# EasyEDA schematic FAN_Dimmer_RE.json
TITLE: Sheet_1; REV: 1.0; Date: 2024-11-26; Sheet: 1/1; Drawn By: AmirB; Company: Your Company
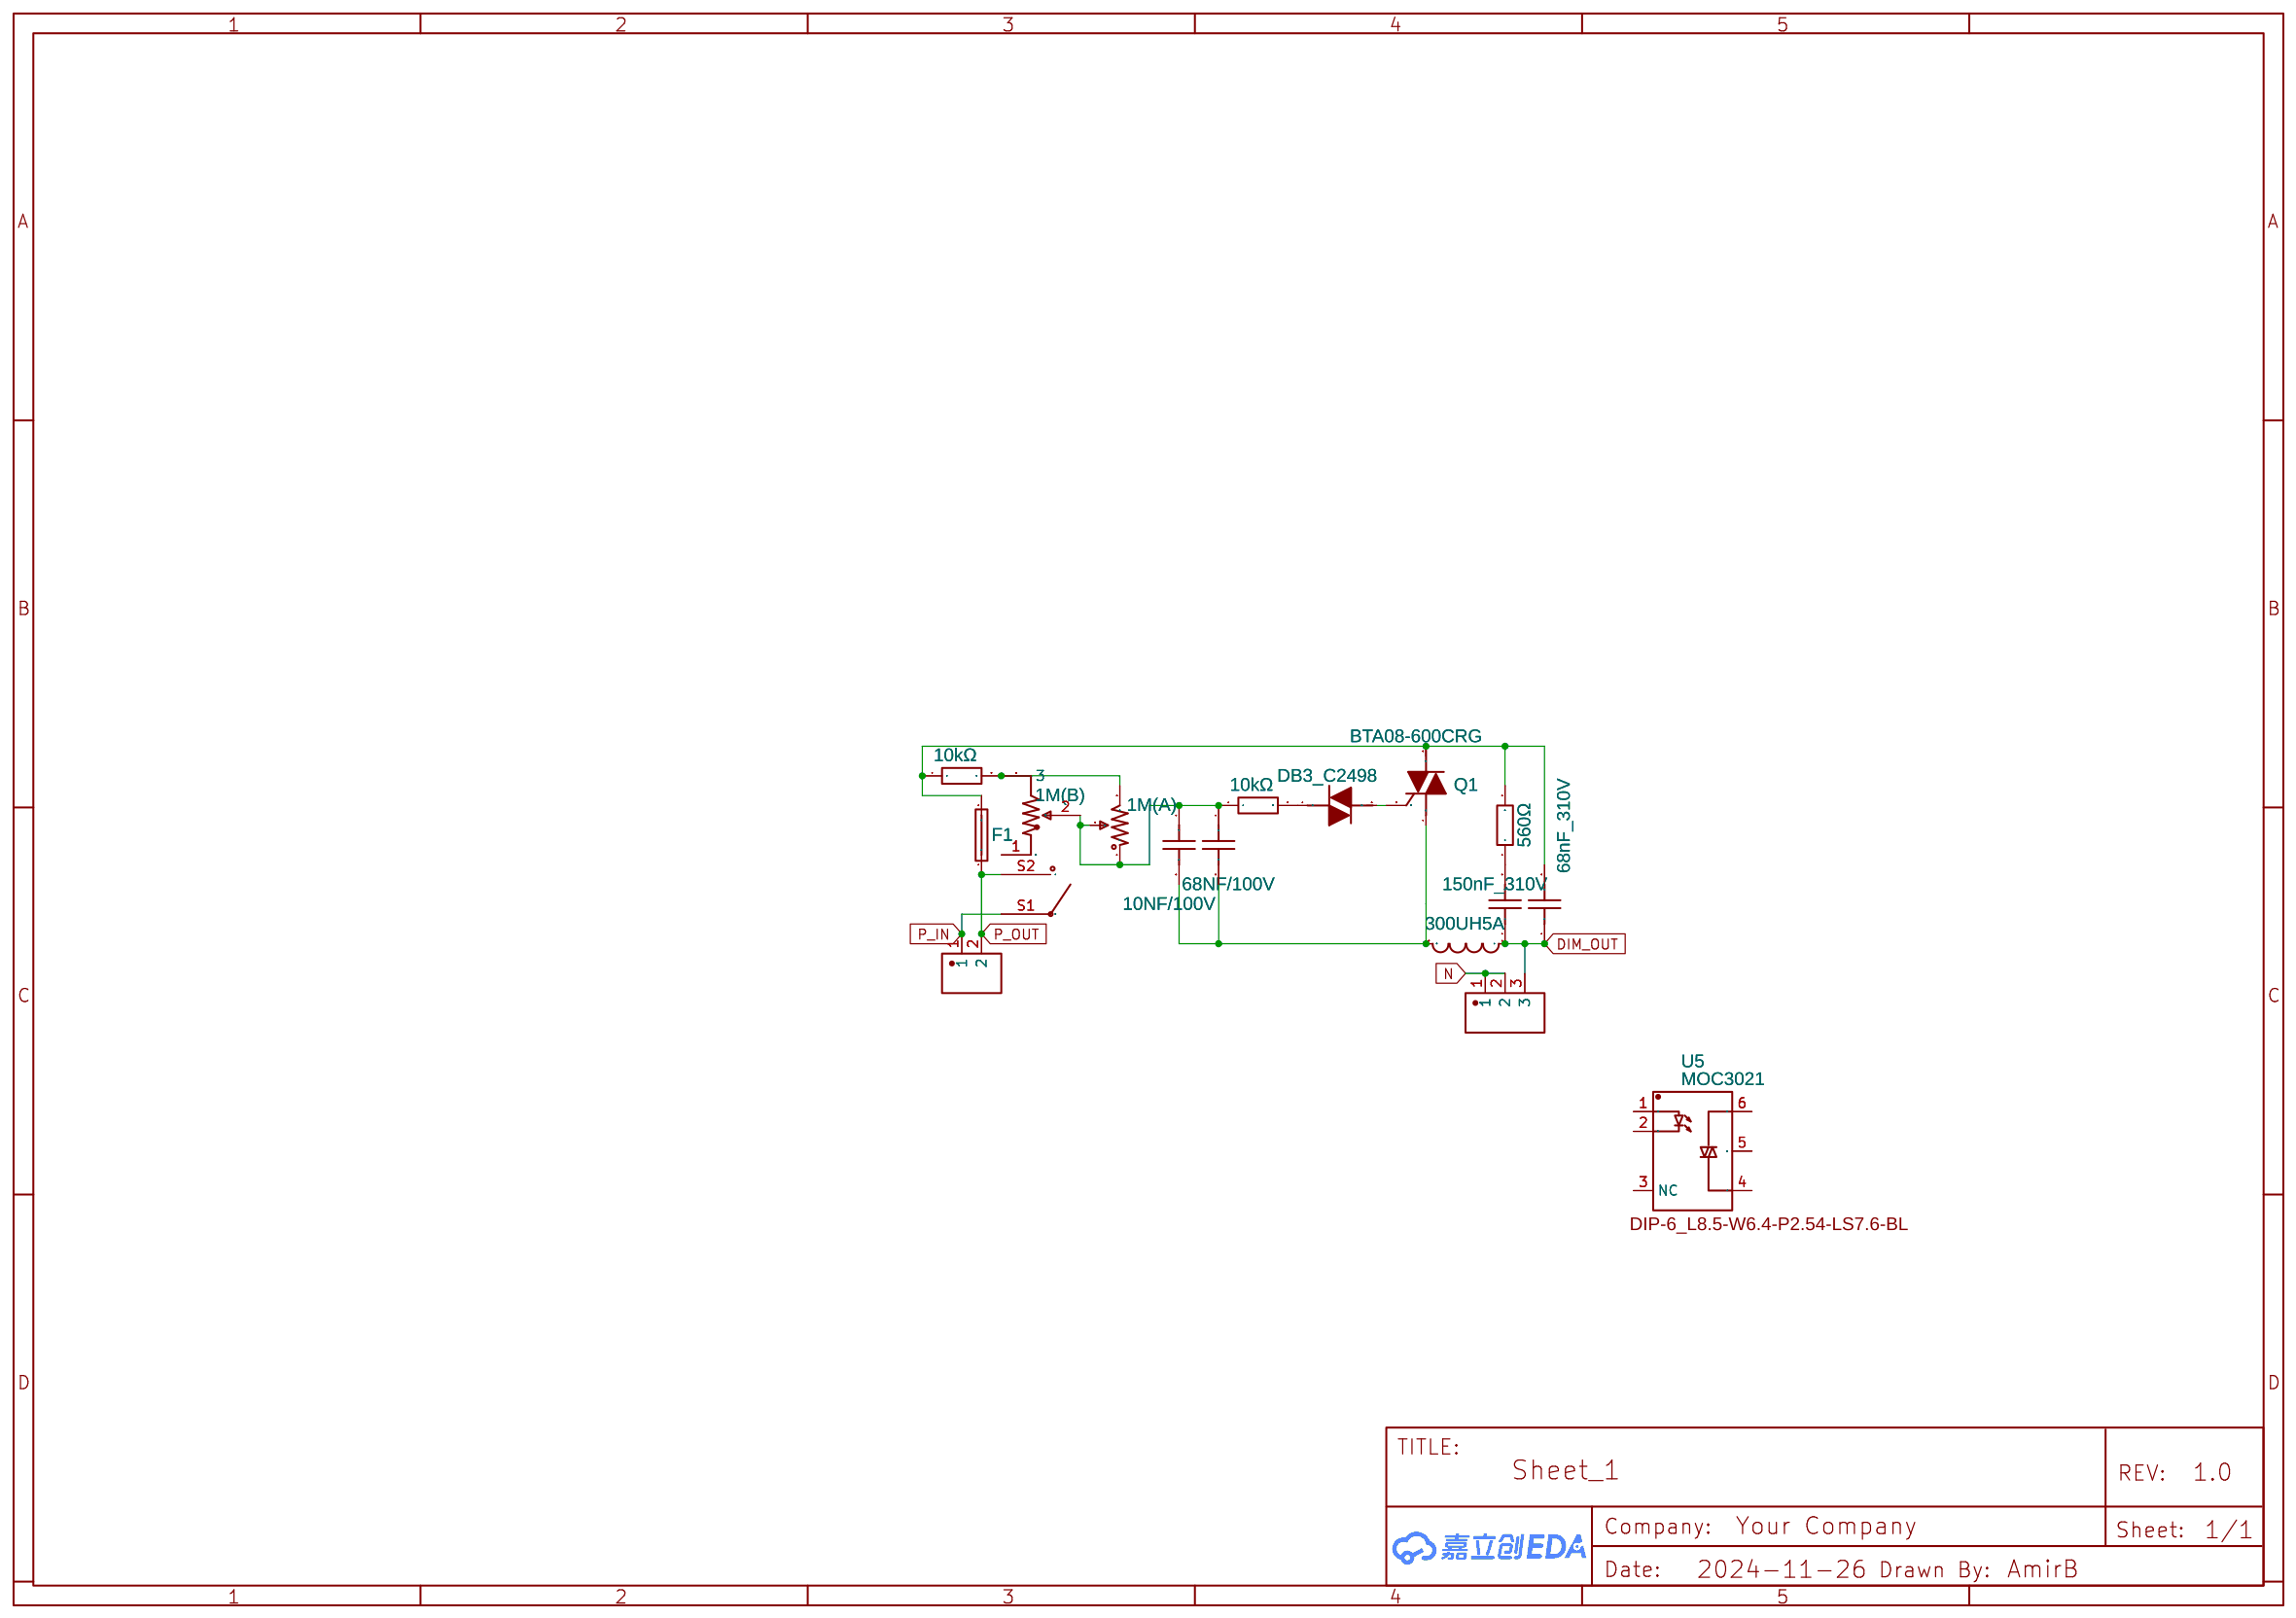
[diagram p0: schematic sheet]

## Parts
C1  68NF/100V  [CAP-TH_L26.4-W7.0-P22.50-D0.7]
C2  10NF/100V  [CAP-TH_L26.4-W7.0-P22.50-D0.7]
C3  68nF_310V  [CAP-TH_L18.0-W6.0-P15.00-D0.6]
C4  150nF_310V  [CAP-TH_L18.0-W6.0-P15.00-D0.6]
F1  0215002.MXEP  [FUSE-TH_BD5.5-L21.5-P25.50-D0.7]
P7  1M(A)  [RES-ADJ-TH_3P-L10.0-W10.0-P2.50-L]
Q1  BTA08-600CRG  [TO-220-3_L10.0-W4.5-P2.54-L]
Q3  DB3_C2498  [DO-35_BD2.0-L4.0-P8.00-D0.5-FD]
R2  1M(B)  [5PIN RV097NS WITH A SWITCH]
RL1V  10kΩ  [R0603]
RL12V  10kΩ  [R0603]
U1  KF301R-5.0-3P  [CONN-TH_3P-P5.00_KF301R-5.0-3P]
U2  KF301-5.0-2P  [CONN-TH_P5.00_KF301-5.0-2P]
U3  300UH5A  [IND-TH_BD26.0-P10.80_300UH5A]
U4  560Ω  [RES-TH_BD4.5-L11.5-P15.50-D0.8]
U5  MOC3021  [DIP-6_L8.5-W6.4-P2.54-LS7.6-BL]

## Library data of the parts
C1 C2 = 68NF/1000V: Contributor: lcsc; Supplier: LCSC; Supplier Part: C9900021245; Manufacturer: null; JLCPCB Part Class: Extended Part; Package Display: No
C3 C4 = K155K310VD7L15: Contributor: lcsc; Supplier: LCSC; Supplier Part: C2686078; Manufacturer: JIERONG(捷容); JLCPCB Part Class: Extended Part; Package Display: No
F1 = 0215002.MXEP: Contributor: LCSC; Supplier: LCSC; Supplier Part: C142787; Manufacturer: Littelfuse(美国力特); JLCPCB Part Class: Extended Part; Package Display: No
P7 = 3296W-1-103: Resistance(Ohms): 10K; Contributor: LCSC; JLCPCB Part Class: Extended Part; Package Display: No
Q1 = BTA08-600CRG: Supplier: LCSC; Manufacturer: ST(意法半导体); Supplier Part: C9102; JLCPCB Part Class: Extended Part; Package Display: No
Q3 = DB3_C2498: Supplier: LCSC; Manufacturer: ST(先科); Supplier Part: C2498; JLCPCB Part Class: Extended Part; Package Display: No
R2 = 5Pin RV097NS with a Switch: Manufacturer Part: RV097NS; Supplier Part: undefined; Contributor: Home Made Channel; Package Display: No
RL1V RL12V = 0603WAF1002T5E: Supplier: LCSC; Manufacturer: UNI-ROYAL(厚声); Supplier Part: C25804; Resistance (Ohms): 10K; JLCPCB Part Class: Basic Part; Package Display: No
U1 = KF301R-5.0-3P: Contributor: LCSC; Supplier: LCSC; Supplier Part: C474884; Manufacturer: KEFA(科发); JLCPCB Part Class: Extended Part; Package Display: No
U2 = KF301-5.0-2P: Contributor: LCSC; Supplier: LCSC; Supplier Part: C474881; Manufacturer: KEFA(科发); JLCPCB Part Class: Extended Part; Package Display: No
U3 = 300UH5A: Contributor: LCSC; Supplier: LCSC; Supplier Part: C9900011335; Manufacturer: null; JLCPCB Part Class: Extended Part; Package Display: No
U4 = CFR2WSJR-73-560R: Contributor: lcsc; Supplier: LCSC; Supplier Part: C1757877; Manufacturer: YAGEO(国巨); JLCPCB Part Class: Extended Part; Package Display: No
U5 = MOC3021: Contributor: LCSC; Supplier: LCSC; Supplier Part: C123202; Manufacturer: LITEON(光宝); JLCPCB Part Class: Extended Part; Package Display: Yes

## Nets
DIM_OUT: C3.1 C4.1 U1.3 U3.1
N: U1.1 U1.2
P_IN: R2.S1(2) U2.1
P_OUT: F1.1 R2.S2(1) U2.2
Net-(C1-1): C1.1 C2.1 P7.1 P7.2 R2.2(OUT) RL12V.1
Net-(C1-2): C1.2 C2.2 Q1.1(M1) U3.2
Net-(C3-2): C3.2 F1.2 Q1.2(M2) RL1V.1 U4.2
Net-(C4-2): C4.2 U4.1
Net-(P7-3): P7.3 R2.3 RL1V.2
Net-(Q1-3): Q1.3(G) Q3.2(M2)
Net-(Q3-1): Q3.1(M1) RL12V.2

Not connected (* = marked no-connect by the designer): R2 1(gnd); U5 1 2 3(NC) 4(E) 5(SUB) 6(BASE)
